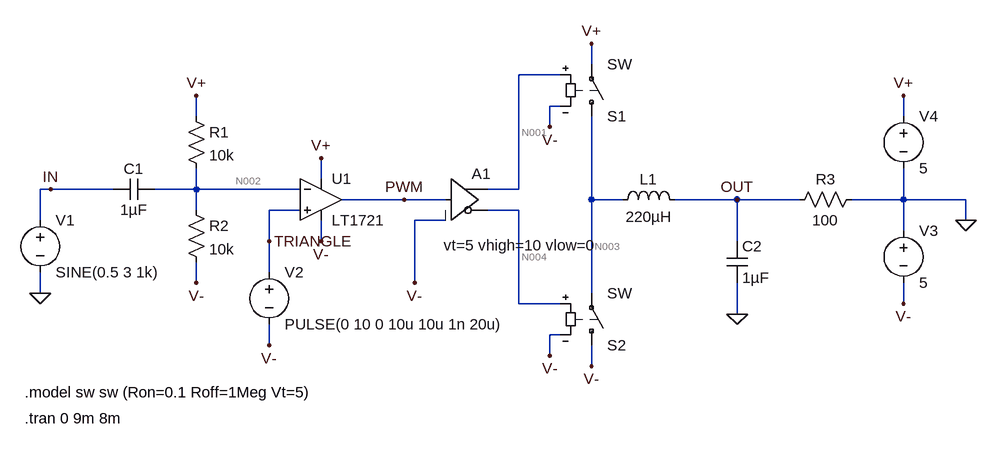
[diagram p0: schematic Class D Power Amps.asc]
Class D Power Amps.asc, the LTspice schematic file:
Version 4
SHEET 1 1444 680
WIRE 848 -64 848 -96
WIRE 800 -48 736 -48
WIRE 800 0 784 0
WIRE 240 16 240 -16
WIRE 1328 16 1328 -16
WIRE 784 32 784 0
WIRE 432 112 432 80
WIRE 16 128 0 128
WIRE 112 128 16 128
WIRE 240 128 240 96
WIRE 240 128 176 128
WIRE 400 128 240 128
WIRE 736 128 736 -48
WIRE 736 128 688 128
WIRE 560 144 464 144
WIRE 624 144 560 144
WIRE 848 144 848 16
WIRE 896 144 848 144
WIRE 1072 144 976 144
WIRE 1168 144 1072 144
WIRE 1328 144 1328 96
WIRE 1328 144 1248 144
WIRE 1424 144 1328 144
WIRE 240 160 240 128
WIRE 400 160 352 160
WIRE 736 160 688 160
WIRE 0 176 0 128
WIRE 624 176 576 176
WIRE 1424 176 1424 144
WIRE 1328 192 1328 144
WIRE 352 208 352 160
WIRE 432 208 432 176
WIRE 1072 208 1072 144
WIRE 352 256 352 208
WIRE 240 272 240 240
WIRE 576 272 576 176
WIRE 0 288 0 256
WIRE 848 288 848 144
WIRE 736 304 736 160
WIRE 800 304 736 304
WIRE 1328 304 1328 272
WIRE 1072 320 1072 272
WIRE 800 352 784 352
WIRE 352 368 352 336
WIRE 784 384 784 352
WIRE 848 400 848 368
FLAG 0 288 0
FLAG 1072 320 0
FLAG 1424 176 0
FLAG 1328 -16 V+
FLAG 848 -96 V+
FLAG 432 80 V+
FLAG 240 -16 V+
FLAG 1328 304 V-
FLAG 848 400 V-
FLAG 784 384 V-
FLAG 784 32 V-
FLAG 576 272 V-
FLAG 432 208 V-
FLAG 352 368 V-
FLAG 240 272 V-
FLAG 16 128 IN
FLAG 352 208 TRIANGLE
FLAG 560 144 PWM
FLAG 1072 144 OUT
SYMBOL voltage 0 160 R0
WINDOW 123 0 0 Left 0
WINDOW 39 0 0 Left 0
SYMATTR InstName V1
SYMATTR Value SINE(0.5 3 1k)
SYMBOL cap 176 112 R90
WINDOW 0 0 32 VBottom 2
WINDOW 3 32 32 VTop 2
SYMATTR InstName C1
SYMATTR Value 1µF
SYMBOL res 224 0 R0
SYMATTR InstName R1
SYMATTR Value 10k
SYMBOL res 224 144 R0
SYMATTR InstName R2
SYMATTR Value 10k
SYMBOL Comparators\\LT1721 432 80 R0
SYMATTR InstName U1
SYMBOL voltage 352 240 R0
WINDOW 123 0 0 Left 0
WINDOW 39 0 0 Left 0
SYMATTR InstName V2
SYMATTR Value PULSE(0 10 0 10u 10u 1n 20u)
SYMBOL Digital\\buf 624 80 R0
WINDOW 3 -3 134 Left 2
SYMATTR InstName A1
SYMATTR Value vt=5 vhigh=10 vlow=0
SYMBOL sw 848 32 M180
SYMATTR InstName S1
SYMBOL sw 848 384 M180
SYMATTR InstName S2
SYMBOL ind 880 160 R270
WINDOW 0 32 56 VTop 2
WINDOW 3 5 56 VBottom 2
SYMATTR InstName L1
SYMATTR Value 220µH
SYMBOL cap 1056 208 R0
SYMATTR InstName C2
SYMATTR Value 1µF
SYMBOL res 1264 128 R90
WINDOW 0 0 56 VBottom 2
WINDOW 3 32 56 VTop 2
SYMATTR InstName R3
SYMATTR Value 100
SYMBOL voltage 1328 176 R0
WINDOW 123 0 0 Left 0
WINDOW 39 0 0 Left 0
SYMATTR InstName V3
SYMATTR Value 5
SYMBOL voltage 1328 0 R0
WINDOW 123 0 0 Left 0
WINDOW 39 0 0 Left 0
SYMATTR InstName V4
SYMATTR Value 5
TEXT -24 440 Left 2 !.model sw sw (Ron=0.1 Roff=1Meg Vt=5)
TEXT -24 480 Left 2 !.tran 0 9m 8m

The netlist it stands for:
* Class D Power Amps.asc
V1 IN 0 SINE(0.5 3 1k)
C1 N002 IN 1µF
R1 V+ N002 10k
R2 N002 V- 10k
XU1 TRIANGLE N002 V+ V- PWM LT1720  ; LT1721, pins In+ In- V+ V- OUT
V2 TRIANGLE V- PULSE(0 10 0 10u 10u 1n 20u)
A1 PWM V- V- V- V- N004 N001 V- BUF vt=5 vhigh=10 vlow=0
S1 N003 V+ N001 V- SW
S2 V- N003 N004 V- SW
L1 N003 OUT 220µH
C2 OUT 0 1µF
R3 0 OUT 100
V3 0 V- 5
V4 V+ 0 5
.model sw sw (Ron=0.1 Roff=1Meg Vt=5)
.tran 0 9m 8m
.lib LTC.lib
.backanno
.end

* Results of the author's LTspice run, read from the files saved beside the schematic
* Operating Point, zero values left out:
*   V(in) = 500 mV
*   V(n002) = 500 nV
*   V(v+) = 5 V
*   V(v-) = -5 V
*   V(triangle) = -5 V
*   V(pwm) = -4.828 V
*   V(n004) = 5 V
*   V(n001) = -5 V
*   V(n003) = -4.995 V
*   V(out) = -4.995 V
*   I(L1) = -49.95 mA
*   I(R3) = 49.95 mA
*   I(R2) = 500 µA
*   I(R1) = 500 µA
*   I(S2) = 49.96 mA
*   I(S1) = 9.995 µA
*   I(V4) = -7.015 mA
*   I(V3) = -56.97 mA
*   I(V2) = 5 µA
*   Ix(u1:1) = -5 µA
*   Ix(u1:2) = -100 pA
*   Ix(u1:3) = 6.505 mA
*   Ix(u1:4) = -6.5 mA
*   Ix(u1:5) = 9.644 pA
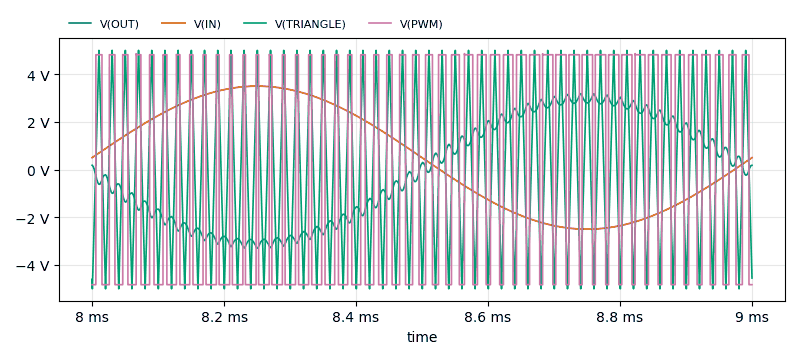
[diagram p1: Transient Analysis of Class D Power Amps.asc, plotted from the saved traces]
* Transient Analysis, 1 run:
*   V(OUT): min -3.299 V, max 3.183 V, average -66.13 mV, rms 2.145 V, last 179.3 mV
*   V(IN): min -2.5 V, max 3.5 V, average 500 mV, rms 2.179 V, last 500 mV
*   V(TRIANGLE): min -5 V, max 5 V, average 478.8 µV, rms 2.946 V, last -4.55 V
*   V(PWM): min -4.828 V, max 4.865 V, average -67.49 mV, rms 4.821 V, last -4.828 V